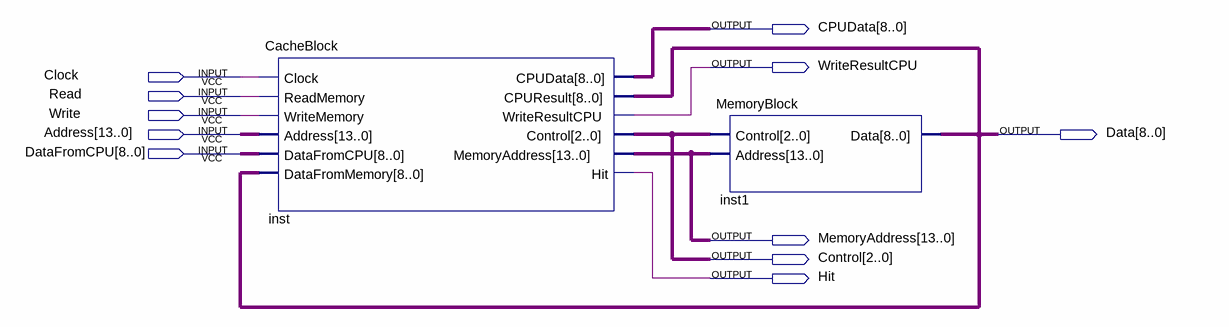
[diagram p0: schematic sheet]
// Quartus schematic CacheWithMemory.bdf as structural Verilog: 2 symbols, 11 pins
module CacheWithMemory (
  input  Clock,
  input  Read,
  input  Write,
  input  [13:0] Address,
  input  [8:0] DataFromCPU,
  output [8:0] CPUData,
  output WriteResultCPU,
  output [8:0] Data,
  output [13:0] MemoryAddress,
  output [2:0] Control,
  output Hit
);

  CacheBlock inst (
    .Clock(Clock), .ReadMemory(Read), .WriteMemory(Write), .Address(Address), .DataFromCPU(DataFromCPU),
    .DataFromMemory(Data), .CPUData(CPUData), .CPUResult(Data), .WriteResultCPU(WriteResultCPU),
    .Control(Control), .MemoryAddress(MemoryAddress), .Hit(Hit));
  MemoryBlock inst1 (.Control(Control), .Address(MemoryAddress), .Data(Data));
endmodule
